# Altium schematic sheet Supply-DC3V3.SchDoc
size 420 x 297 mm; SheetNumber: 6; SheetTotal: 7
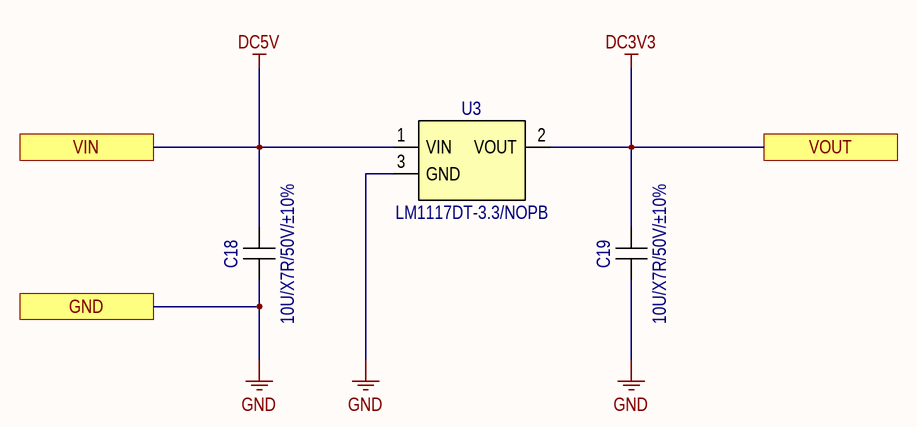
[diagram p0: Supply-DC3V3.SchDoc]

## Parts
C18  value 10U/X7R/50V/±10%  [Normal_Capacitor_Standard_1206-L3200-W1600-BW1250-H1600]  (hidden comment: CL31B106KBHNNNE)
C19  value 10U/X7R/50V/±10%  [Normal_Capacitor_Standard_1206-L3200-W1600-BW1250-H1600]  (hidden comment: CL31B106KBHNNNE)
U3  LM1117DT-3.3/NOPB  [SOT223]

## Ports
GND, VIN, VOUT

## Nets
DC3V3: C19.2 U3.2(VOUT) ; port VOUT
DC5V: C18.2 U3.1(VIN) ; port VIN
GND: C18.1 C19.1 U3.3(GND) ; port GND

## Notes on the sheet
- Изм.
- Лист
- № докум.
- Дата
- Стр.
- Подп.

## Library data of the parts
C18 C19 = CL31B106KBHNNNE: Ceramic Capacitor SMD 1210
U3 = LM1117DT-3.3/NOPB: pin to pad: 1>3 2>2+4 3>1